# EAGLE schematic main (EAGLE 9.6.2)

## Sheet 1 of 4
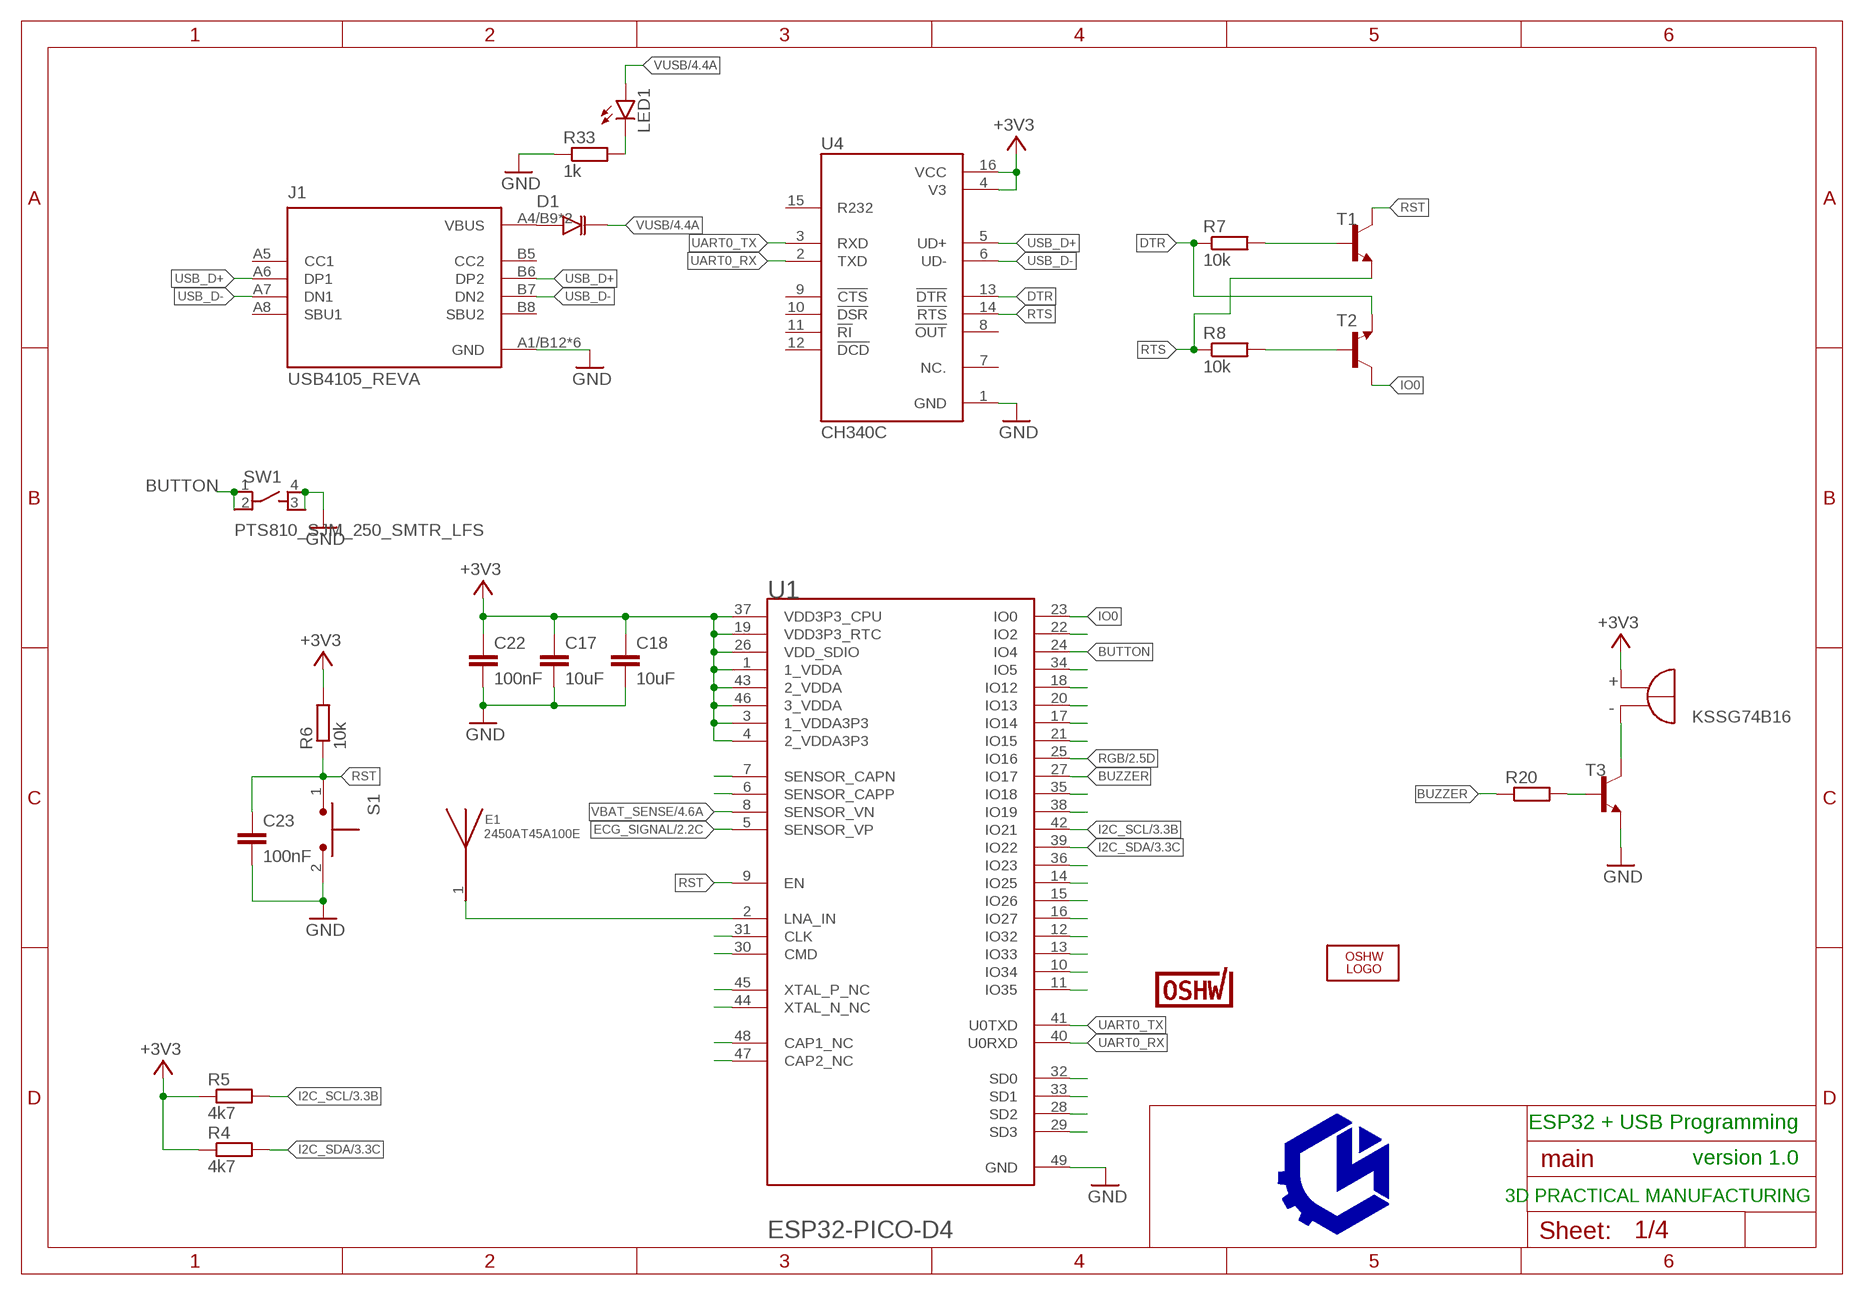
[diagram p0: schematic, sheet 1]

### Parts
C17  10uF  C-EUC0603  [C0603]
C18  10uF  C-EUC0603  [C0603]
C22  100nF  C-EUC0603  [C0603]
C23  100nF  C-EUC0603  [C0603]
D1  ZMV829BTA  [SOD2512X116N]
E1  2450AT45A100E  [ANT_2450AT45A100E]
J1  USB4105_REVA  [GCT_USB4105_REVA]
LED1  LEDCHIP-LED0603  [CHIP-LED0603]
LOGO2  OSHW_LOGO_FILLX0200-NT  [OSHW_FILLX200_NOTEXT]
LS1  KSSG74B16  [XDCR_KSSG74B16]
R4  4k7  R-EU_R0603  [R0603]
R5  4k7  R-EU_R0603  [R0603]
R6  10k  R-EU_R0603  [R0603]
R7  10k  R-EU_R0603  [R0603]
R8  10k  R-EU_R0603  [R0603]
R20  R-EU_R0603  [R0603]
R33  1k  R-EU_R0603  [R0603]
S1  TL1015AF160QG  [SW_TL1015AF160QG]
SW1  PTS810_SJM_250_SMTR_LFS  [SW_PTS810_SJM_250_SMTR_LFS]
T1  MMBT4401LT1-NPN-SOT23-BEC  [SOT23-BEC]
T2  MMBT4401LT1-NPN-SOT23-BEC  [SOT23-BEC]
T3  MMBT4401LT1-NPN-SOT23-BEC  [SOT23-BEC]
U1  ESPRESSIF_SYSTEMS_ESP32-PICO-D4ESPRESSIF_SYSTEMS_ESP32-PICO-D4_0_2  [ESPRESSIF_SYSTEMS_ESP32-PICO-D4_2]
U4  CH340C  [SOIC127P600X180-16N]
U$10  CERT-SMALL  [CERT-SMALL-SILK]

### Nets
+3V3: C17.1 C18.1 C22.1 LS1.P(POS) R4.1 R5.1 R6.2 U1.1(1_VDDA) U1.3(1_VDDA3P3) U1.4(2_VDDA3P3) U1.19(VDD3P3_RTC) U1.26(VDD_SDIO) U1.37(VDD3P3_CPU) U1.43(2_VDDA) U1.46(3_VDDA) U4.4(V3) U4.16(VCC) ; also sheet 2,3,4
BUTTON: SW1.1 SW1.2 U1.24(IO4)
BUZZER: R20.1 U1.27(IO17)
DTR: R7.1 T2.E U4.13(!DTR)
ECG_SIGNAL: U1.5(SENSOR_VP) ; also sheet 2
GND: C17.2 C18.2 C22.2 C23.2 J1.A1/B12(GND) J1.B1/A12(GND) J1.G1(GND) J1.G2(GND) J1.G3(GND) J1.G4(GND) R33.1 S1.2 SW1.3 SW1.4 T3.E U1.49(GND) U4.1(GND) ; also sheet 2,3,4
I2C_SCL: R5.2 U1.42(IO21) ; also sheet 3
I2C_SDA: R4.2 U1.39(IO22) ; also sheet 3
IO0: T2.C U1.23(IO0)
N$1: R7.2 T1.B
N$2: R8.2 T2.B
N$5: R20.2 T3.B
N$15: E1.1 U1.2(LNA_IN)
N$20: D1.A J1.A4/B9(VBUS) J1.B4/A9(VBUS)
N$22: LS1.N(NEG) T3.C
N$32: U1.31(CLK)
N$33: U1.7(SENSOR_CAPN)
N$35: U1.6(SENSOR_CAPP)
N$37: U1.30(CMD)
N$40: U1.45(XTAL_P_NC)
N$41: U1.44(XTAL_N_NC)
N$42: U1.48(CAP1_NC)
N$43: U1.47(CAP2_NC)
N$44: U1.11(IO35)
N$45: U1.10(IO34)
N$46: U1.13(IO33)
N$47: U1.12(IO32)
N$48: U1.16(IO27)
N$49: U1.15(IO26)
N$50: U1.14(IO25)
N$51: U1.36(IO23)
N$52: U1.38(IO19)
N$53: U1.35(IO18)
N$54: U1.21(IO15)
N$55: U1.17(IO14)
N$56: U1.20(IO13)
N$57: U1.18(IO12)
N$58: U1.34(IO5)
N$59: U1.22(IO2)
N$60: U1.32(SD0)
N$61: U1.33(SD1)
N$62: U1.28(SD2)
N$63: U1.29(SD3)
N$64: LED1.C R33.2
RGB: U1.25(IO16) ; also sheet 2
RST: C23.1 R6.1 S1.1 T1.C U1.9(EN)
RTS: R8.1 T1.E U4.14(!RTS)
UART0_RX: U1.40(U0RXD) U4.2(TXD)
UART0_TX: U1.41(U0TXD) U4.3(RXD)
USB_D+: J1.A6(DP1) J1.B6(DP2) U4.5(UD+)
USB_D-: J1.A7(DN1) J1.B7(DN2) U4.6(UD-)
VBAT_SENSE: U1.8(SENSOR_VN) ; also sheet 4
VUSB: D1.K LED1.A ; also sheet 4
Unconnected: J1.A5(CC1) J1.A8(SBU1) J1.B5(CC2) J1.B8(SBU2) U4.7(NC.) U4.8(!OUT) U4.9(!CTS) U4.10(!DSR) U4.11(!RI) U4.12(!DCD) U4.15(R232)

### Notes on the sheet
- ESP32 + USB Programming
- version 1.0
- 3D PRACTICAL MANUFACTURING

## Sheet 2 of 4
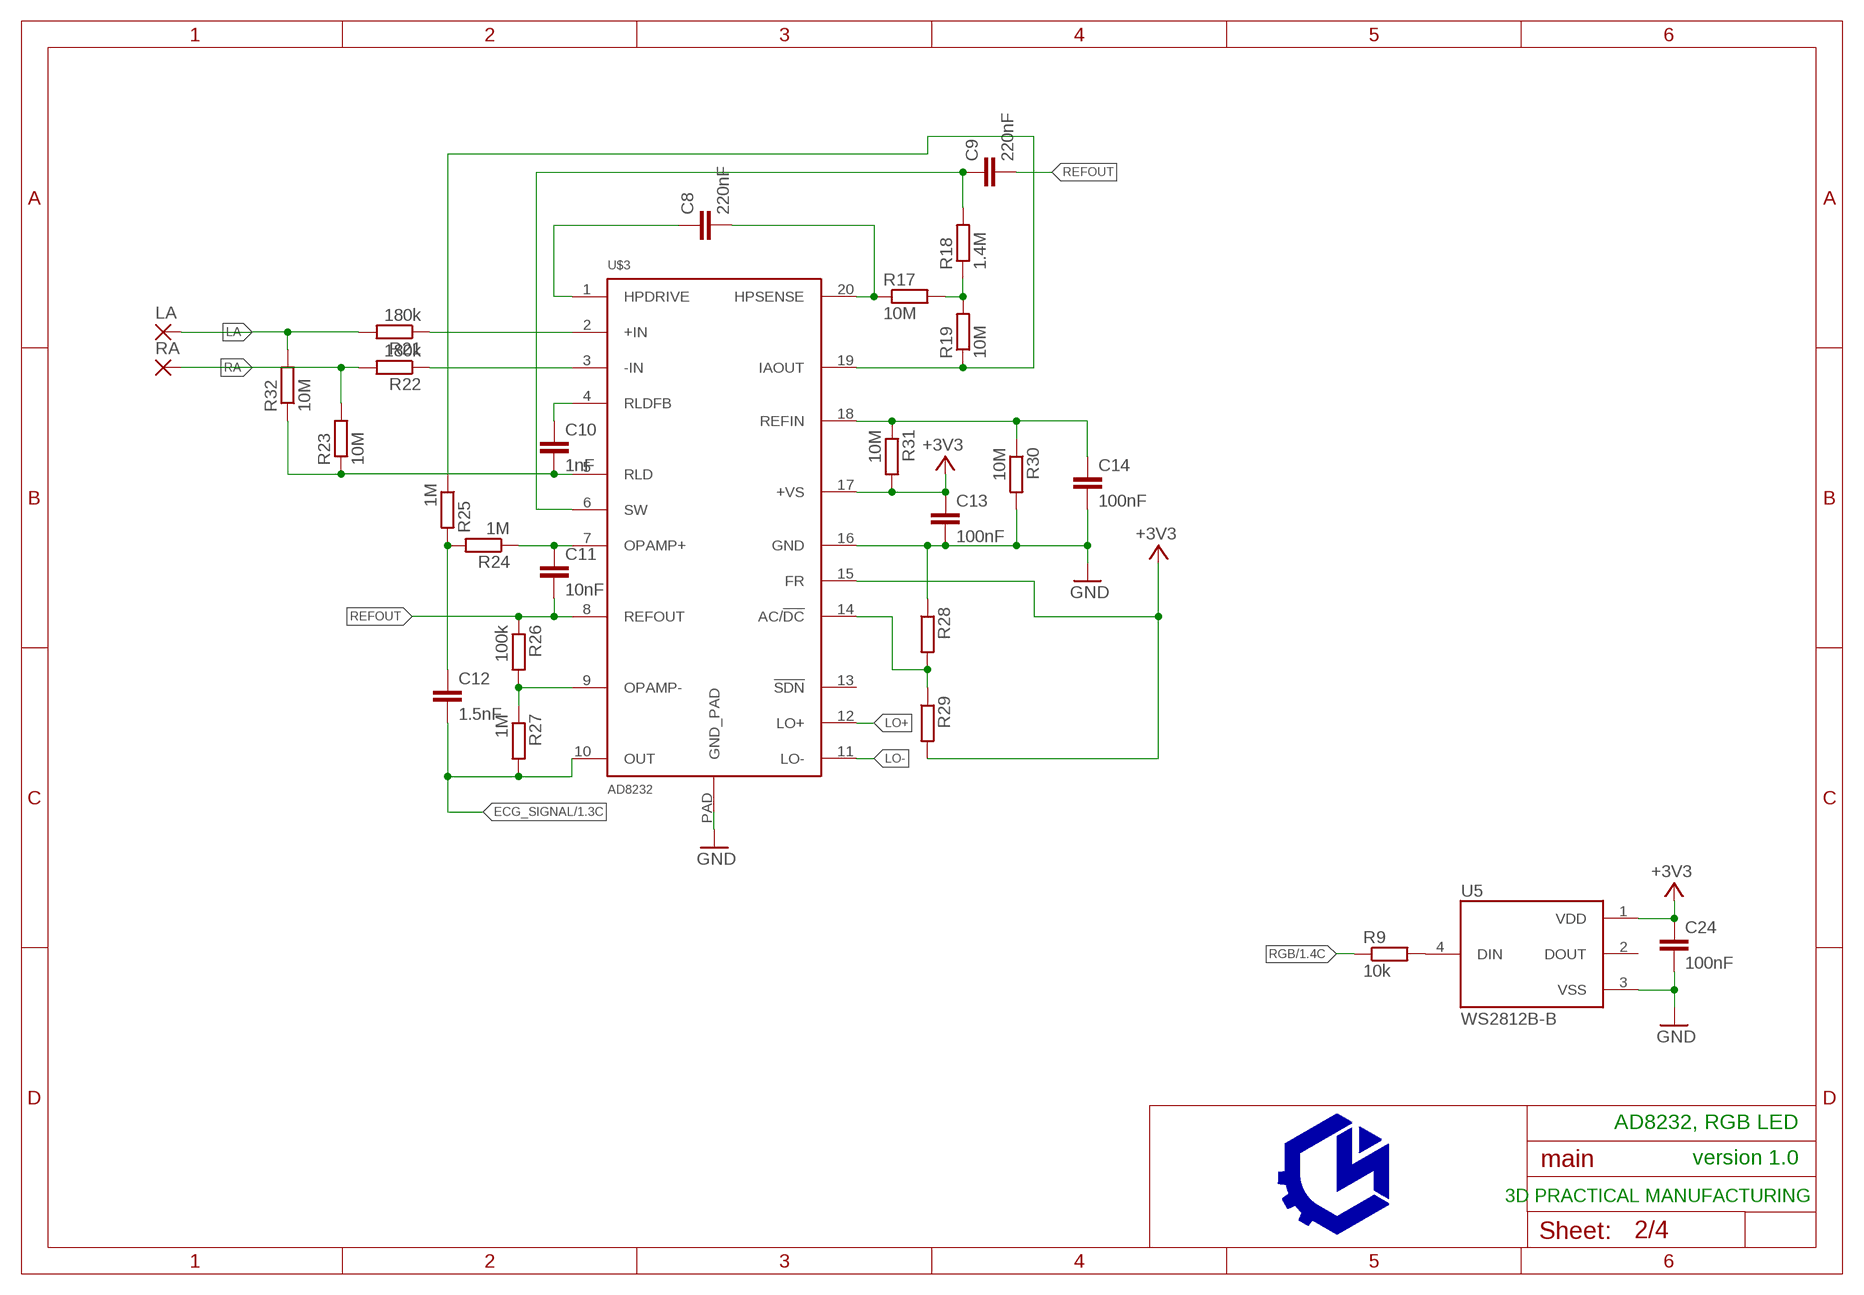
[diagram p1: schematic, sheet 2]

### Parts
C8  220nF  C-EUC0603  [C0603]
C9  220nF  C-EUC0603  [C0603]
C10  1nF  C-EUC0603  [C0603]
C11  10nF  C-EUC0603  [C0603]
C12  1.5nF  C-EUC0603  [C0603]
C13  100nF  C-EUC0603  [C0603]
C14  100nF  C-EUC0603  [C0603]
C24  100nF  C-EUC0603  [C0603]
LA  SMD2  [SMD1,27-2,54]
R9  10k  R-EU_R0603  [R0603]
R17  10M  R-EU_R0603  [R0603]
R18  1.4M  R-EU_R0603  [R0603]
R19  10M  R-EU_R0603  [R0603]
R21  180k  R-EU_R0603  [R0603]
R22  180k  R-EU_R0603  [R0603]
R23  10M  R-EU_R0603  [R0603]
R24  1M  R-EU_R0603  [R0603]
R25  1M  R-EU_R0603  [R0603]
R26  100k  R-EU_R0603  [R0603]
R27  1M  R-EU_R0603  [R0603]
R28  R-EU_R0603  [R0603]
R29  R-EU_R0603  [R0603]
R30  10M  R-EU_R0603  [R0603]
R31  10M  R-EU_R0603  [R0603]
R32  10M  R-EU_R0603  [R0603]
RA  SMD2  [SMD1,27-2,54]
U5  WS2812B-B  [LED_WS2812B-B]
U$3  AD8232  [LFCSP_20]

### Nets
+3V3: C13.1 C24.1 R29.2 R31.2 U5.1(VDD) U$3.15(FR) U$3.17(+VS) ; also sheet 1,3,4
ECG_SIGNAL: C12.2 R27.2 U$3.10(OUT) ; also sheet 1
GND: C13.2 C14.2 C24.2 R28.1 R30.2 U5.3(VSS) U$3.16(GND) U$3.PAD(GND_PAD) ; also sheet 1,3,4
LA: LA.1(P) R21.2 R32.2
LO+: U$3.12(LO+)
LO-: U$3.11(LO-)
N$3: R9.2 U5.4(DIN)
N$10: C8.2 R17.1 U$3.20(HPSENSE)
N$11: C8.1 U$3.1(HPDRIVE)
N$12: R19.1 R25.1 U$3.19(IAOUT)
N$13: R17.2 R18.1 R19.2
N$14: C9.1 R18.2 U$3.6(SW)
N$16: C12.1 R24.2 R25.2
N$18: R21.1 U$3.2(+IN)
N$19: R22.1 U$3.3(-IN)
N$30: C10.1 U$3.4(RLDFB)
N$31: C10.2 R23.1 R32.1 U$3.5(RLD)
N$34: C11.1 R24.1 U$3.7(OPAMP+)
N$36: R26.2 R27.1 U$3.9(OPAMP-)
N$38: R28.2 R29.1 U$3.14(AC/!DC)
N$39: C14.1 R30.1 R31.1 U$3.18(REFIN)
RA: R22.2 R23.2 RA.1(P)
REFOUT: C9.2 C11.2 R26.1 U$3.8(REFOUT)
RGB: R9.1 ; also sheet 1
Unconnected: U5.2(DOUT) U$3.13(!SDN)

### Notes on the sheet
- AD8232, RGB LED
- version 1.0
- 3D PRACTICAL MANUFACTURING

## Sheet 3 of 4
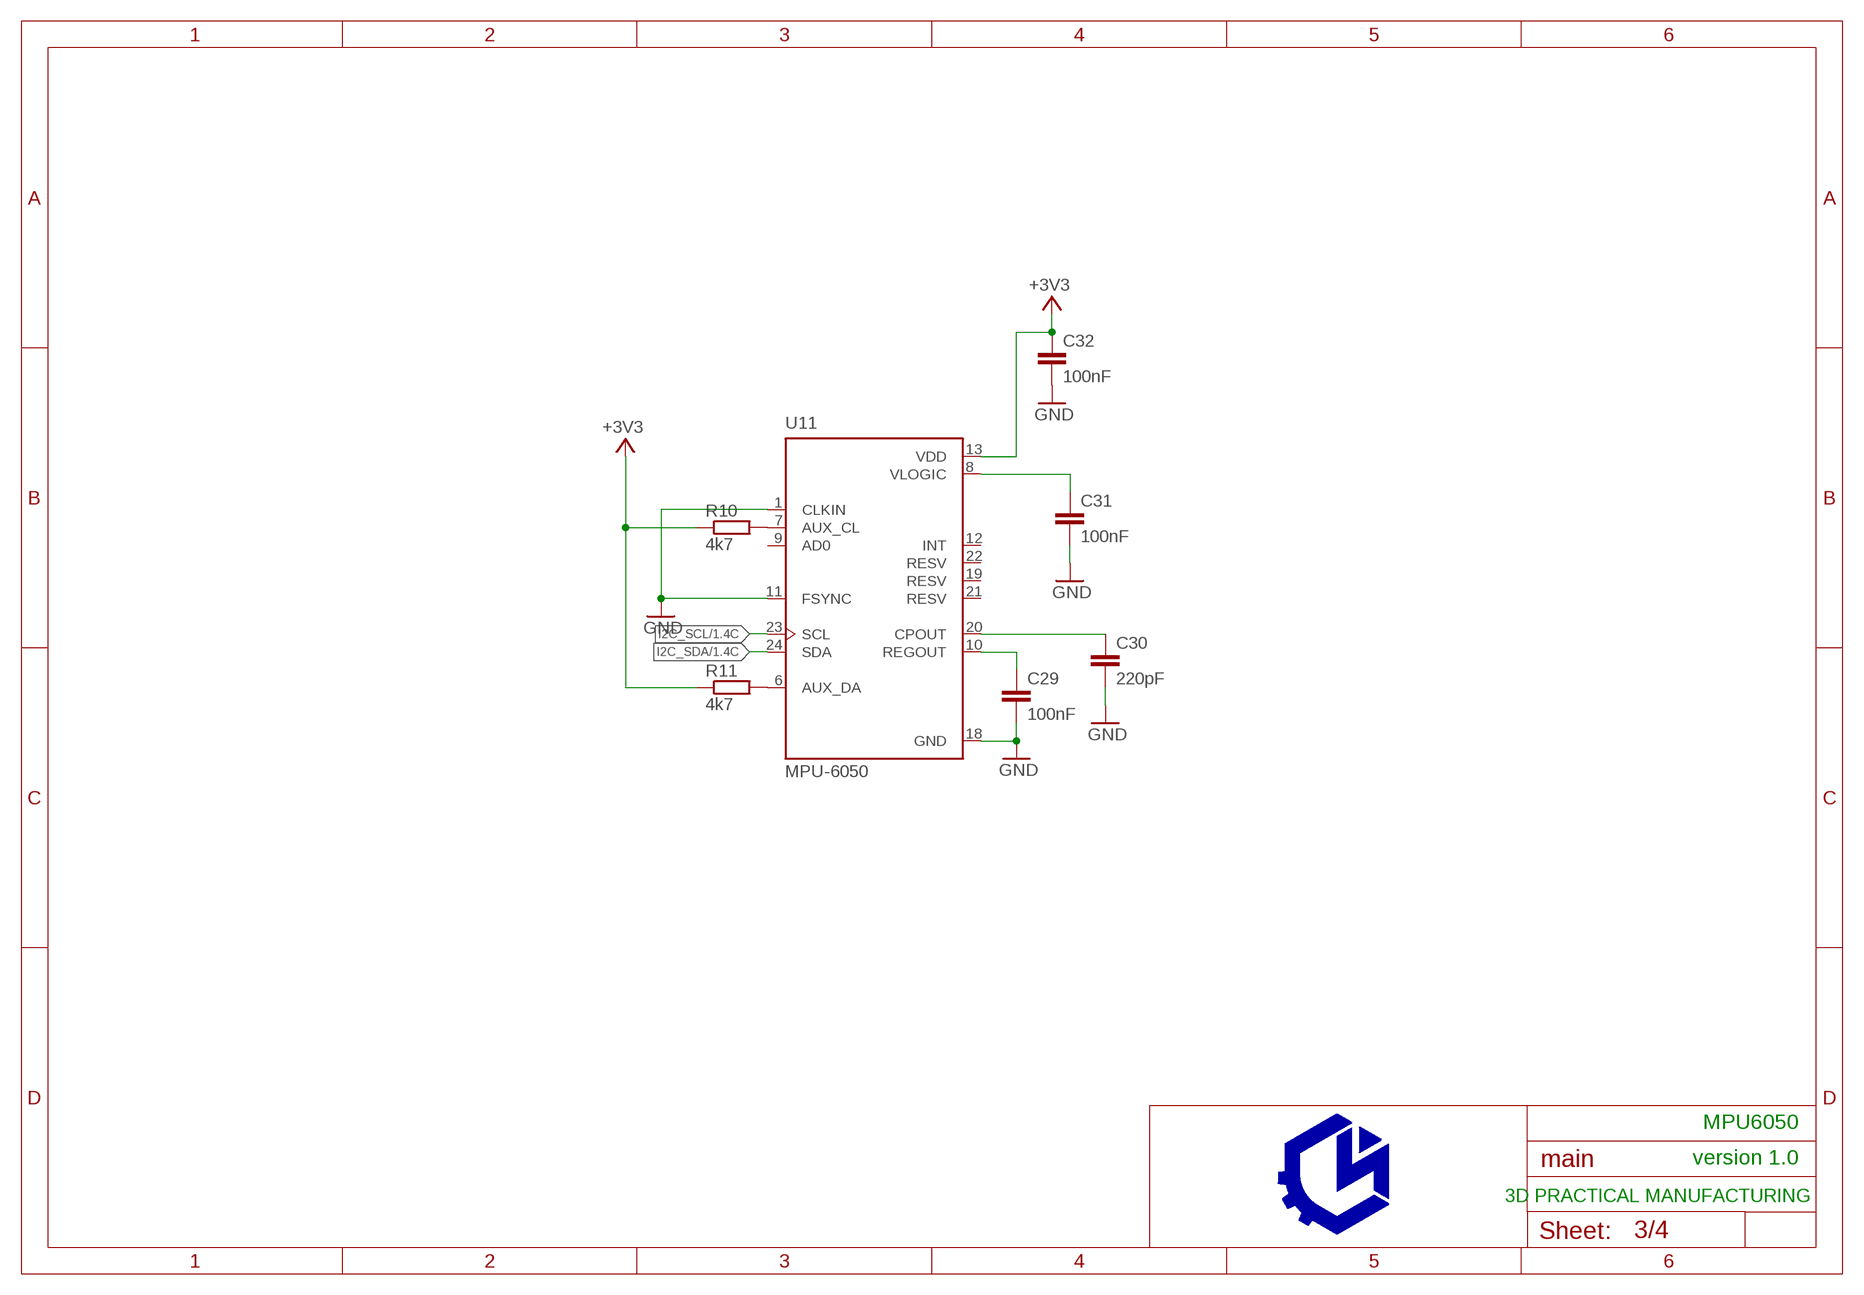
[diagram p2: schematic, sheet 3]

### Parts
C29  100nF  C-EUC0603  [C0603]
C30  220pF  C-EUC0603  [C0603]
C31  100nF  C-EUC0603  [C0603]
C32  100nF  C-EUC0603  [C0603]
R10  4k7  R-EU_R0603  [R0603]
R11  4k7  R-EU_R0603  [R0603]
U11  MPU-6050  [QFN50P400X400X95-24N]

### Nets
+3V3: C32.1 R10.1 R11.1 U11.13(VDD) ; also sheet 1,2,4
GND: C29.2 C30.2 C31.2 C32.2 U11.1(CLKIN) U11.11(FSYNC) U11.18(GND) ; also sheet 1,2,4
I2C_SCL: U11.23(SCL) ; also sheet 1
I2C_SDA: U11.24(SDA) ; also sheet 1
N$8: C29.1 U11.10(REGOUT)
N$24: R10.2 U11.7(AUX_CL)
N$25: R11.2 U11.6(AUX_DA)
N$26: C31.1 U11.8(VLOGIC)
N$27: C30.1 U11.20(CPOUT)
Unconnected: U11.9(AD0) U11.12(INT) U11.19(RESV) U11.21(RESV) U11.22(RESV)

### Notes on the sheet
- MPU6050
- version 1.0
- 3D PRACTICAL MANUFACTURING

## Sheet 4 of 4
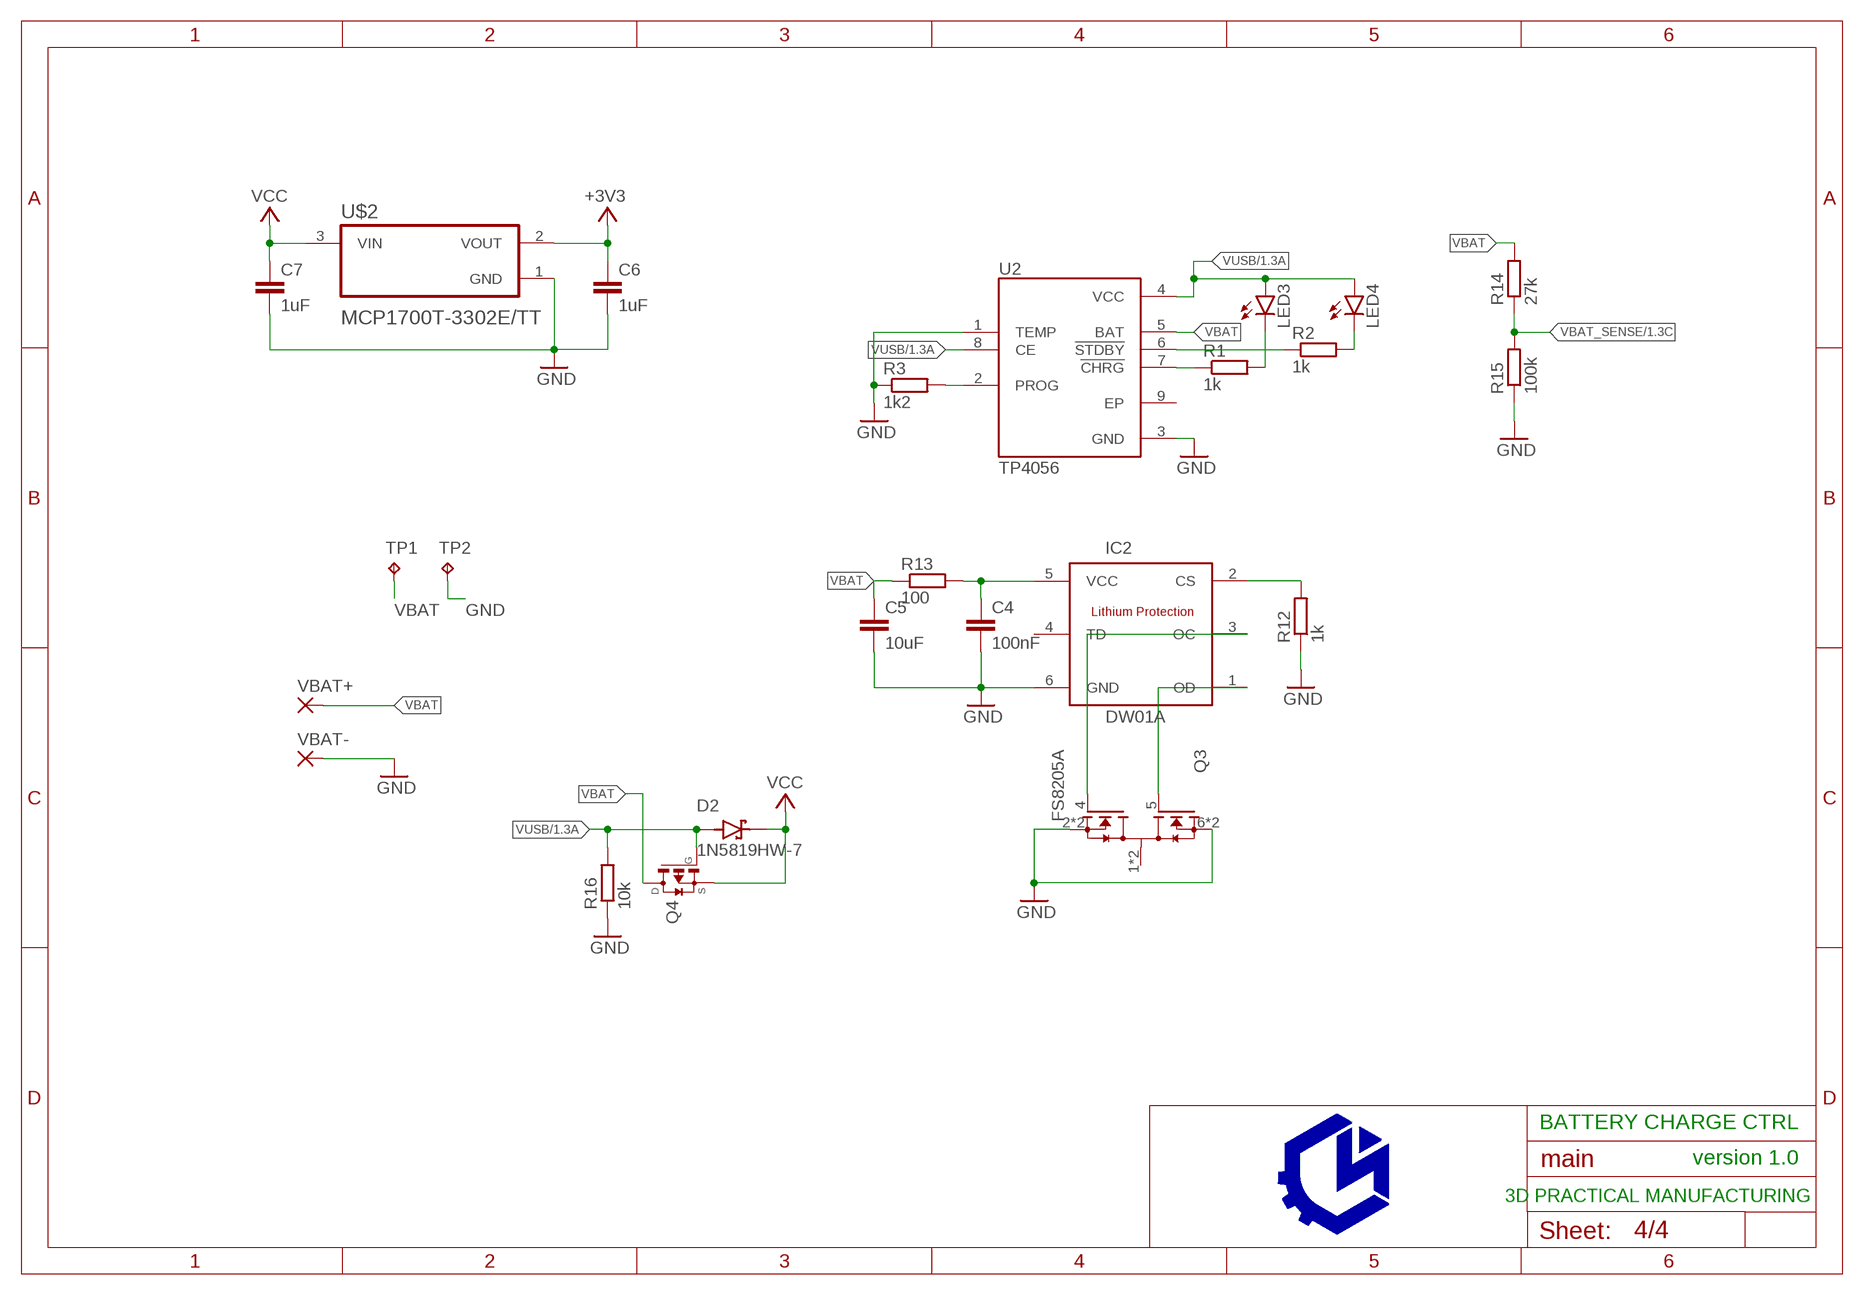
[diagram p3: schematic, sheet 4]

### Parts
C4  100nF  C-EUC0603  [C0603]
C5  10uF  C-EUC0603  [C0603]
C6  1uF  C-EUC0603  [C0603]
C7  1uF  C-EUC0603  [C0603]
D2  1N5819HW-7  [SOD3715X145N]
IC2  DW01A  [SOT23-6]
LED3  LEDCHIP-LED0603  [CHIP-LED0603]
LED4  LEDCHIP-LED0603  [CHIP-LED0603]
Q3  FS8205A  [SOP65P640X120-8N]
Q4  TRANSISTOR-FET_DMP2004K  [TRANSISTOR-FET_SOT23]
R1  1k  R-EU_R0603  [R0603]
R2  1k  R-EU_R0603  [R0603]
R3  1k2  R-EU_R0603  [R0603]
R12  1k  R-EU_R0603  [R0603]
R13  100  R-EU_R0603  [R0603]
R14  27k  R-EU_R0603  [R0603]
R15  100k  R-EU_R0603  [R0603]
R16  10k  R-EU_R0603  [R0603]
TP1  TPB1,27  [B1,27]
TP2  TPB1,27  [B1,27]
U2  TP4056  [SOP127P600X175-9N]
U$2  MCP1700T-3302E/TT  [SOT95P237X112-3N]
VBAT+  WIREPADSMD1,27-254  [SMD1,27-2,54]
VBAT-  WIREPADSMD1,27-254  [SMD1,27-2,54]

### Nets
+3V3: C6.1 U$2.2(VOUT) ; also sheet 1,2,3
GND: C4.2 C5.2 C6.2 C7.2 IC2.6(GND) Q3.2(S1) Q3.3(S1) Q3.6(S2) Q3.7(S2) R3.1 R12.1 R15.1 R16.1 TP2.TP U2.1(TEMP) U2.3(GND) U$2.1(GND) VBAT-.1(P) ; also sheet 1,2,3
N$4: R2.1 U2.6(!STDBY)
N$6: LED3.C R1.2
N$7: LED4.C R2.2
N$9: R1.1 U2.7(!CHRG)
N$17: R3.2 U2.2(PROG)
N$21: IC2.1(OD) Q3.5(G2)
N$23: IC2.3(OC) Q3.4(G1)
N$28: IC2.2(CS) R12.2
N$29: C4.1 IC2.5(VCC) R13.2
VBAT: C5.1 Q4.3(D) R13.1 R14.2 TP1.TP U2.5(BAT) VBAT+.1(P)
VBAT_SENSE: R14.1 R15.2 ; also sheet 1
VCC: C7.1 D2.C(K) Q4.2(S) U$2.3(VIN)
VUSB: D2.A LED3.A LED4.A Q4.1(G) R16.2 U2.4(VCC) U2.8(CE) ; also sheet 1
Unconnected: IC2.4(TD) Q3.1(D12) Q3.8(D12) U2.9(EP)

### Notes on the sheet
- BATTERY CHARGE CTRL
- version 1.0
- 3D PRACTICAL MANUFACTURING

## Library data of the parts
C4-C14 C17 C18 C22-C24 C29-C32 = rcl:C-EU: CAPACITOR, European symbol; SPICEPREFIX: C
D1 = ZMV829BTA:ZMV829BTA: Varactors Single 25V Surface Mount SOD-323 Check availability <https://pricing.snapeda.com/parts/ZMV829BTA/Diodes%20Inc./view-part?ref=eda>; AVAILABILITY: In Stock; DESCRIPTION: Varactors Single 25 V Surface Mount SOD-323; MF: Diodes Inc.; MP: ZMV829BTA; PACKAGE: SOD-323 Diodes Inc.; PRICE: None; PURCHASE-URL: https://pricing.snapeda.com/search/part/ZMV829BTA/?ref=eda
D2 = 1N5819HW-7:1N5819HW-7: 1N5819HW Series 40 V 1 A Surface Mount Schottky Barrier Rectifier - SOD-123 Check availability <https://pricing.snapeda.com/parts/1N5819HW-7/Diodes%20Inc./view-part?ref=eda>; AVAILABILITY: In Stock; DESCRIPTION: Diode Schottky 40 V 1A Surface Mount SOD-123; MF: Diodes Inc.; MP: 1N5819HW-7; PACKAGE: SOD-123 Fairchild Semiconductor; PRICE: None; PURCHASE-URL: https://pricing.snapeda.com/search/part/1N5819HW-7/?ref=eda
E1 = 2450AT45A100E:2450AT45A100E: ANTENNA, CERAMIC, 2.45GHZ; Bandwidth: 100MHz; Frequency: 2.45GHz; Gain: 1dB; Impedance: 50ohm Check availability <https://pricing.snapeda.com/parts/2450AT45A100E/Johanson%20Technology/view-part?ref=eda>; AVAILABILITY: In Stock; DESCRIPTION: 2.4GHz - Chip RF Antenna 2.4GHz ~ 2.5GHz 2.2dBi Solder Surface Mount; MF: Johanson Technology; MP: 2450AT45A100E; PACKAGE: None; PRICE: None; PURCHASE-URL: https://pricing.snapeda.com/search/part/2450AT45A100E/?ref=eda
IC2 = DW01A:DW01A: Check availability <https://pricing.snapeda.com/parts/DW01A/Fortune%20Semiconductor/view-part?ref=eda>; AVAILABILITY: Not in stock; DESCRIPTION: One Cell Lithium-ion/Polymer Battery Protection IC; MF: Fortune Semiconductor; MP: DW01A; PACKAGE: SOT-23-6 Fortune Semiconductor; PRICE: None
J1 = USB4105_REVA:USB4105_REVA: USB Type C Receptacle for USB 2.0 SMT Type, PCB Top Mount; AVAILABILITY: Unavailable; DESCRIPTION: USB-C (USB TYPE-C) USB 2.0 Receptacle Connector 24 (16+8 Dummy) Position Surface Mount, Right Angle; Through Hole; MF: Global Connector Technology; MP: USB4105; PACKAGE: Package; PRICE: None
LA RA = wirepad:SMD2: SMD PAD
LED1 LED3 LED4 = led:LED: LED OSRAM: - CHIPLED LG R971, LG N971, LY N971, LG Q971, LY Q971, LO R971, LY R971 LH N974, LH R974 LS Q976, LO Q976, LY Q976 LO Q996 - Hyper CHIPLED LW Q18S LB Q993, LB Q99A, LB R99A - SideLED LS A670, LO A670, LY A670, LG A670, LP A670 LB A673, LV A673, LT A673, LW A673 LH A674 LY A675 LS A676, LA A676, LO A676, LY A676, LW A676 LS A679, LY A679, LG A679 - Hyper Micro SIDELED® LS Y876, LA Y876, LO Y876, LY Y876 LT Y87S - SmartLED LW L88C, LW L88S LB L89C, LB L89S, LG L890 LS L89K, LO L89K, LY L89K LS L896, LA L896, LO L896, LY L896 - TOPLED LS T670, LO T670, LY T670, LG T670, LP T670 LSG T670, LSP T670, LSY T670, LOP T670, LYG T670 LG T671, LOG T671, LSG T671 LB T673, LV T673, LT T673, LW T673 LH T674 LS T676, LA T676, LO T676, LY T676, LB T676, LH T676, LSB T676, LW T676 LB T67C, LV T67C, LT T67C, LS T67K, LO T67K, LY T67K, LW E67C LS E67B, LA E67B, LO E67B, LY E67B, LB E67C, LV E67C, LT E67C LW T67C LS T679, LY T679, LG T679 LS T770, LO T770, LY T770, LG T770, LP T770 LB T773, LV T773, LT T773, LW T773 LH T774 LS E675, LA E675, LY E675, LS T675 LS T776, LA T776, LO T776, LY T776, LB T776 LHGB T686 LT T68C, LB T68C - Hyper Mini TOPLED® LB M676 - Mini TOPLED Santana® LG M470 LS M47K, LO M47K, LY M47K Source: http://www.osram.convergy.de LUXEON: - LUMILED® LXK2-PW12-R00, LXK2-PW12-S00, LXK2-PW14-U00, LXK2-PW14-V00 LXK2-PM12-R00, LXK2-PM12-S00, LXK2-PM14-U00 LXK2-PE12-Q00, LXK2-PE12-R00, LXK2-PE12-S00, LXK2-PE14-T00, LXK2-PE14-U00 LXK2-PB12-K00, LXK2-PB12-L00, LXK2-PB12-M00, LXK2-PB14-N00, LXK2-PB14-P00, LXK2-PB14-Q00 LXK2-PR12-L00, LXK2-PR12-M00, LXK2-PR14-Q00, LXK2-PR14-R00 LXK2-PD12-Q00, LXK2-PD12-R00, LXK2-PD12-S00 LXK2-PH12-R00, LXK2-PH12-S00 LXK2-PL12-P00, LXK2-PL12-Q00, LXK2-PL12-R00 Source: www.luxeon.com KINGBRIGHT: KA-3528ASYC Source: www.kingbright.com
LOGO2 = ohw-logo:OSHW_LOGO_FILL
LS1 = KSSG74B16:KSSG74B16: Check availability <https://pricing.snapeda.com/parts/KSSG74B16/Kingstate/view-part?ref=eda>; AVAILABILITY: In Stock; DESCRIPTION: 8.5mm, 3.6V, 2.73KHz, 87dB, High SPL Magnetic Buzzer, SMT; MF: Kingstate; MP: KSSG74B16; PACKAGE: DIP-16 kingstate; PRICE: None
Q3 = FS8205A:FS8205A: N/A Check availability <https://pricing.snapeda.com/parts/FS8205A/Fortune%20Semiconductor/view-part?ref=eda>; AVAILABILITY: Not in stock; MF: Fortune Semiconductor; MP: FS8205A; PACKAGE: Package; PRICE: None
Q4 = 52101-101-REV-A_v16:TRANSISTOR-FET_DMP2004K: P-Channel Enhancement MOSFET
R1-R33 = rcl:R-EU_: RESISTOR, European symbol; SPICEPREFIX: R
S1 = TL1015AF160QG:TL1015AF160QG: Tactile Switch SPST-NO Top Actuated Surface Mount Check prices <https://pricing.snapeda.com/parts/TL1015AF160QG/E-Switch/view-part?ref=eda>; AVAILABILITY: In Stock; DESCRIPTION: Tactile Switch SPST-NO Top Actuated Surface Mount; MF: E-Switch; MP: TL1015AF160QG; PACKAGE: SOIC-14 E-Switch; PRICE: None; PURCHASE-URL: https://pricing.snapeda.com/search/part/TL1015AF160QG/?ref=eda
SW1 = PTS810_SJM_250_SMTR_LFS:PTS810_SJM_250_SMTR_LFS: Switch Tactile Spst-No 0.05a 16v Check prices <https://pricing.snapeda.com/parts/PTS810%20SJM%20250%20SMTR%20LFS/C%26K/view-part?ref=eda>; AVAILABILITY: In Stock; DESCRIPTION: Tactile Switch SPST-NO Top Actuated Surface Mount; MF: C&K; MP: PTS810 SJM 250 SMTR LFS; PACKAGE: None; PRICE: None; PURCHASE-URL: https://pricing.snapeda.com/search/part/PTS810 SJM 250 SMTR LFS/?ref=eda
T1-T3 = DC_LOAD_AU:*-NPN-: NPN Transistror BF959 corrected 2008.03.06
TP1 TP2 = testpad:TP: Test pad
U1 = Espressif Systems - ESP32-PICO-D4:ESPRESSIF_SYSTEMS_ESP32-PICO-D4: Bluetooth, WiFi 802.11b/g/n, Bluetooth v4.2 + EDR, Class 1, 2 and 3 Transceiver Module 2.4GHz ~ 2.5GHz Surface Mount; AUTOMOTIVE: No; BANDWIDTH: 72MHz; CENTROID_NOT_SPECIFIED: No; DATASHEET: https://www.espressif.com/sites/default/files/documentation/esp32-pico-d4_datasheet_en.pdf; DATA_RATE: 150Mbits/s; DEVICE_CLASS_L1: Integrated Circuits (ICs); DEVICE_CLASS_L2: RF Semiconductors and Devices; DEVICE_CLASS_L3: Transceivers; DIGIKEY_DESCRIPTION: RX TXRX MOD WIFI SURFACE MOUNT; DIGIKEY_PART_NUMBER: 1904-1029-1-ND; FOOTPRINT_PARAMETERS_0: {"fp_type":"QFN","params":{"N1":{"nom":12,"long name":"Leads on long side","min":null,"max":null,"short name":"N1","type":"count"},"N2":{"nom":12,"long name":"Leads on wide side","min":null,"max":null,"short name":"N2","type":"count"},"A":{"nom":940000,"long name":"Height","min":840000,"max":1040000,"short name":"A","type":"measurement"},"A1":{"nom":false,"long name":"Package clearance","min":0,"max":50000,"short name":"A1","type":"measurement"},"A2":{"nom":false,"long name":"Package height","min":false,"max":1040000,"short name":"A2","type":"measurement"},"D":{"nom":7000000,"long name":"Package length","min":6900000,"max":7100000,"short name":"D","type":"measurement"},"E":{"nom":7000000,"long name":"Package width","min":6900000,"max":7100000,"short name":"E","type":"measurement"},"B":{"nom":250000,"long name":"Lead width","min":200000,"max":300000,"short name":"B","type":"measurement"},"C":{"nom":260000,"long name":"Lead thickness","min":null,"max":null,"short name":"C","type":"measurement"},"L":{"nom":400000,"long name":"Lead foot length","min":325000,"max":475000,"short name":"L","type":"measurement"},"e":{"nom":500000,"long name":"Lead pitch","min":null,"max":null,"short name":"e","type":"measurement"},"D2":{"nom":5400000,"long name":"Thermal pad length","min":5300000,"max":5500000,"short name":"D2","type":"measurement"},"E2":{"nom":5400000,"long name":"Thermal pad width","min":5300000,"max":5500000,"short name":"E2","type":"measurement"},"PC":{"long name":"Paste coverage (%)","type":"percentage","short name":"PC","value":40},"HT":{"default":"Yes","long name":"Thermal pad","type":"multichoiceparent","short name":"HT","children":["D2","E2","PC"]},"offset x":{"nom":0,"long name":"X Center offset","min":null,"max":null,"short name":"offset x","type":"measurement"},"offset y":{"nom":0,"long name":"Y Center offset","min":null,"max":null,"short name":"offset y","type":"measurement"},"LS":{"default":"Rounded rectangle","long name":"Land shape","type":"multichoice","short name":"LS"},"LS1":{"default":"Rectangle","long name":"Land shape (Pin 1)","type":"multichoice","short name":"LS1"},"solder toe":{"nom":400000,"long name":"Solder fillet (toe)","min":null,"max":null,"short name":"solder toe","type":"fixedmeasurement"},"solder heel":{"nom":0,"long name":"Solder fillet (heel)","min":null,"max":null,"short name":"solder heel","type":"fixedmeasurement"},"solder side":{"nom":-40000,"long name":"Solder fillet (side)","min":null,"max":null,"short name":"solder side","type":"fixedmeasurement"},"courtyard":{"nom":500000,"long name":"Courtyard","min":null,"max":null,"short name":"courtyard","type":"fixedmeasurement"},"SF":{"default":"A","long name":"Packing level","type":"multichoiceparent","short name":"SF","help":"http://support.upverter.com/customer/portal/articles/978783-what-is-a-footprint-packing-level","children":["solder toe","solder heel","solder side","courtyard"]}}}; FOOTPRINT_PARAMETERS_1: {"fp_type":"QFN","params":{"N1":{"nom":12,"long name":"Leads on long side","min":null,"max":null,"short name":"N1","type":"count"},"N2":{"nom":12,"long name":"Leads on wide side","min":null,"max":null,"short name":"N2","type":"count"},"A":{"nom":940000,"long name":"Height","min":840000,"max":1040000,"short name":"A","type":"measurement"},"A1":{"nom":false,"long name":"Package clearance","min":0,"max":50000,"short name":"A1","type":"measurement"},"A2":{"nom":false,"long name":"Package height","min":false,"max":1040000,"short name":"A2","type":"measurement"},"D":{"nom":7000000,"long name":"Package length","min":6900000,"max":7100000,"short name":"D","type":"measurement"},"E":{"nom":7000000,"long name":"Package width","min":6900000,"max":7100000,"short name":"E","type":"measurement"},"B":{"nom":250000,"long name":"Lead width","min":200000,"max":300000,"short name":"B","type":"measurement"},"C":{"nom":260000,"long name":"Lead thickness","min":null,"max":null,"short name":"C","type":"measurement"},"L":{"nom":400000,"long name":"Lead foot length","min":325000,"max":475000,"short name":"L","type":"measurement"},"e":{"nom":500000,"long name":"Lead pitch","min":null,"max":null,"short name":"e","type":"measurement"},"D2":{"nom":5400000,"long name":"Thermal pad length","min":5300000,"max":5500000,"short name":"D2","type":"measurement"},"E2":{"nom":5400000,"long name":"Thermal pad width","min":5300000,"max":5500000,"short name":"E2","type":"measurement"},"PC":{"long name":"Paste coverage (%)","type":"percentage","short name":"PC","value":40},"HT":{"default":"Yes","long name":"Thermal pad","type":"multichoiceparent","short name":"HT","children":["D2","E2","PC"]},"offset x":{"nom":0,"long name":"X Center offset","min":null,"max":null,"short name":"offset x","type":"measurement"},"offset y":{"nom":0,"long name":"Y Center offset","min":null,"max":null,"short name":"offset y","type":"measurement"},"LS":{"default":"Rounded rectangle","long name":"Land shape","type":"multichoice","short name":"LS"},"LS1":{"default":"Rectangle","long name":"Land shape (Pin 1)","type":"multichoice","short name":"LS1"},"solder toe":{"nom":300000,"long name":"Solder fillet (toe)","min":null,"max":null,"short name":"solder toe","type":"fixedmeasurement"},"solder heel":{"nom":0,"long name":"Solder fillet (heel)","min":null,"max":null,"short name":"solder heel","type":"fixedmeasurement"},"solder side":{"nom":-40000,"long name":"Solder fillet (side)","min":null,"max":null,"short name":"solder side","type":"fixedmeasurement"},"courtyard":{"nom":250000,"long name":"Courtyard","min":null,"max":null,"short name":"courtyard","type":"fixedmeasurement"},"SF":{"default":"B","long name":"Packing level","type":"multichoiceparent","short name":"SF","help":"http://support.upverter.com/customer/portal/articles/978783-what-is-a-footprint-packing-level","children":["solder toe","solder heel","solder side","courtyard"]}}}; FOOTPRINT_PARAMETERS_2: {"fp_type":"QFN","params":{"N1":{"nom":12,"long name":"Leads on long side","min":null,"max":null,"short name":"N1","type":"count"},"N2":{"nom":12,"long name":"Leads on wide side","min":null,"max":null,"short name":"N2","type":"count"},"A":{"nom":940000,"long name":"Height","min":840000,"max":1040000,"short name":"A","type":"measurement"},"A1":{"nom":false,"long name":"Package clearance","min":0,"max":50000,"short name":"A1","type":"measurement"},"A2":{"nom":false,"long name":"Package height","min":false,"max":1040000,"short name":"A2","type":"measurement"},"D":{"nom":7000000,"long name":"Package length","min":6900000,"max":7100000,"short name":"D","type":"measurement"},"E":{"nom":7000000,"long name":"Package width","min":6900000,"max":7100000,"short name":"E","type":"measurement"},"B":{"nom":250000,"long name":"Lead width","min":200000,"max":300000,"short name":"B","type":"measurement"},"C":{"nom":260000,"long name":"Lead thickness","min":null,"max":null,"short name":"C","type":"measurement"},"L":{"nom":400000,"long name":"Lead foot length","min":325000,"max":475000,"short name":"L","type":"measurement"},"e":{"nom":500000,"long name":"Lead pitch","min":null,"max":null,"short name":"e","type":"measurement"},"D2":{"nom":5400000,"long name":"Thermal pad length","min":5300000,"max":5500000,"short name":"D2","type":"measurement"},"E2":{"nom":5400000,"long name":"Thermal pad width","min":5300000,"max":5500000,"short name":"E2","type":"measurement"},"PC":{"long name":"Paste coverage (%)","type":"percentage","short name":"PC","value":40},"HT":{"default":"Yes","long name":"Thermal pad","type":"multichoiceparent","short name":"HT","children":["D2","E2","PC"]},"offset x":{"nom":0,"long name":"X Center offset","min":null,"max":null,"short name":"offset x","type":"measurement"},"offset y":{"nom":0,"long name":"Y Center offset","min":null,"max":null,"short name":"offset y","type":"measurement"},"LS":{"default":"Rounded rectangle","long name":"Land shape","type":"multichoice","short name":"LS"},"LS1":{"default":"Rectangle","long name":"Land shape (Pin 1)","type":"multichoice","short name":"LS1"},"solder toe":{"nom":200000,"long name":"Solder fillet (toe)","min":null,"max":null,"short name":"solder toe","type":"fixedmeasurement"},"solder heel":{"nom":0,"long name":"Solder fillet (heel)","min":null,"max":null,"short name":"solder heel","type":"fixedmeasurement"},"solder side":{"nom":-40000,"long name":"Solder fillet (side)","min":null,"max":null,"short name":"solder side","type":"fixedmeasurement"},"courtyard":{"nom":100000,"long name":"Courtyard","min":null,"max":null,"short name":"courtyard","type":"fixedmeasurement"},"SF":{"default":"C","long name":"Packing level","type":"multichoiceparent","short name":"SF","help":"http://support.upverter.com/customer/portal/articles/978783-what-is-a-footprint-packing-level","children":["solder toe","solder heel","solder side","courtyard"]}}}; FOOTPRINT_VARIANT_NAME_0: IPC_A; FOOTPRINT_VARIANT_NAME_1: IPC_B; FOOTPRINT_VARIANT_NAME_2: IPC_C; HEIGHT: 1.04mm; INTERFACE: I2C,SPI,UART,I2S,Other; IPC_LAND_PATTERN_NAME: QFN50P700X700X94-48; LEAD_FREE: Yes; MAX_FREQUENCY: 2484MHz; MAX_SUPPLY_VOLTAGE: 3.6V; MF: Espressif Systems; MFG_PACKAGE_IDENT: 0; MFG_PACKAGE_IDENT_DATE: 0; MFG_PACKAGE_IDENT_REV: 0; MIN_SUPPLY_VOLTAGE: 3V; MOUSER_PART_NUMBER: 356-ESP32-PICO-D4; MPN: ESP32-PICO-D4; NOMINAL_SUPPLY_CURRENT: 0.5A; NUMBER_OF_ADC_CHANNELS: 18; NUMBER_OF_GPIO: 23; PACKAGE: QFN48; PREFIX: U; ROHS: Yes; SENSITIVITY: -97dBm; TEMPERATURE_RANGE_HIGH: +85°C; TEMPERATURE_RANGE_LOW: -40°C; VERIFICATION_VERSION: 0.0.0.3
U2 = TP4056:TP4056: Complete single cell Li-Ion battery with a constant current / constant voltage linear charger Check availability <https://pricing.snapeda.com/parts/TP4056/NanJing%20Top%20Power%20ASIC%20Corp./view-part?ref=eda>; AVAILABILITY: Not in stock; DESCRIPTION: Complete single cell Li-Ion battery with a constant current / constant voltage linear charger; MF: NanJing Top Power ASIC Corp.; MP: TP4056; PACKAGE: None; PRICE: None
U4 = CH340C:CH340C: USB to serial chip CH340 Check availability <https://pricing.snapeda.com/parts/CH340C/WCH/view-part?ref=eda>; AVAILABILITY: Not in stock; DESCRIPTION: USB to serial chip CH340; MF: WCH; MP: CH340C; PACKAGE: None; PRICE: None
U5 = WS2812B-B:WS2812B-B: Intelligent control LED integrated light source Check availability <https://pricing.snapeda.com/parts/WS2812B-B/Worldsemi/view-part?ref=eda>; AVAILABILITY: Not in stock; DESCRIPTION: Intelligent control LED integrated light source; MF: Worldsemi; MP: WS2812B-B; PACKAGE: Package; PRICE: None
U11 = MPU-6050:MPU-6050: MPU-6050 Six-Axis (Gyro + Accelerometer) MEMS MotionTracking™ Devices Check availability <https://pricing.snapeda.com/parts/MPU-6050/TDK%20InvenSense/view-part?ref=eda>; AVAILABILITY: In Stock; DESCRIPTION: MPU-6050 series Accelerometer, Gyroscope, 3 Axis Sensor Evaluation Board; MF: TDK InvenSense; MP: MPU-6050; PACKAGE: QFN-24 InvenSense; PRICE: None; PURCHASE-URL: https://pricing.snapeda.com/search/part/MPU-6050/?ref=eda
U$2 = MCP1700T-3302E_TT:MCP1700T-3302E/TT: Check availability <https://pricing.snapeda.com/parts/MCP1700T-3302E/TT/Microchip/view-part?ref=eda>; AVAILABILITY: In Stock; DESCRIPTION: Linear Voltage Regulator IC Positive Fixed 1 Output 250mA SOT-23-3; MF: Microchip; MP: MCP1700T-3302E/TT; PACKAGE: SOT-23 Microchip; PRICE: None; PURCHASE-URL: https://pricing.snapeda.com/search/part/MCP1700T-3302E/TT/?ref=eda
U$3 = AD8232:AD8232: Check availability <https://pricing.snapeda.com/parts/AD8232/Analog%20Devices%2C%20Inc./view-part?ref=eda>; AVAILABILITY: In Stock; DESCRIPTION: AD8232 Analog Front End Evaluation Board; MF: Analog Devices, Inc.; MP: AD8232; PACKAGE: None; PRICE: None; PURCHASE-URL: https://pricing.snapeda.com/search/part/AD8232/?ref=eda
U$10 = OSHWA:CERT
VBAT+ VBAT- = wirepad:WIREPAD: Wire PAD connect wire on PCB